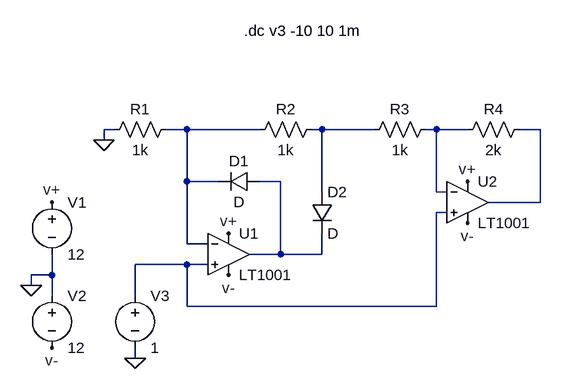
[diagram p0: schematic rect_preci1.asc]
rect_preci1.asc, the LTspice schematic file:
Version 4
SHEET 1 880 680
WIRE -32 0 -48 0
WIRE 80 0 48 0
WIRE 192 0 80 0
WIRE 288 0 272 0
WIRE 368 0 288 0
WIRE 464 0 448 0
WIRE 512 0 464 0
WIRE 624 0 592 0
WIRE -48 16 -48 0
WIRE 80 80 80 0
WIRE 128 80 80 80
WIRE 224 80 192 80
WIRE 288 96 288 0
WIRE 464 96 464 0
WIRE 480 96 464 96
WIRE 624 112 624 0
WIRE 624 112 544 112
WIRE 480 128 464 128
WIRE 80 176 80 80
WIRE 112 176 80 176
WIRE 224 192 224 80
WIRE 224 192 176 192
WIRE 288 192 288 160
WIRE 288 192 224 192
WIRE 80 208 0 208
WIRE 112 208 80 208
WIRE -128 224 -128 192
WIRE -128 224 -160 224
WIRE -160 240 -160 224
WIRE -128 256 -128 224
WIRE 0 256 0 208
WIRE 80 272 80 208
WIRE 464 272 464 128
WIRE 464 272 80 272
WIRE 0 352 0 336
FLAG -160 240 0
FLAG -128 112 v+
FLAG 144 160 v+
FLAG 512 80 v+
FLAG -128 336 v-
FLAG 144 224 v-
FLAG 512 144 v-
FLAG -48 16 0
FLAG 0 352 0
SYMBOL OpAmps\\LT1001 144 128 R0
SYMATTR InstName U1
SYMBOL OpAmps\\LT1001 512 48 R0
SYMATTR InstName U2
SYMBOL voltage -128 96 R0
WINDOW 123 0 0 Left 0
WINDOW 39 0 0 Left 0
SYMATTR InstName V1
SYMATTR Value 12
SYMBOL voltage -128 240 R0
WINDOW 123 0 0 Left 0
WINDOW 39 0 0 Left 0
SYMATTR InstName V2
SYMATTR Value 12
SYMBOL diode 192 64 R90
WINDOW 0 0 32 VBottom 2
WINDOW 3 32 32 VTop 2
SYMATTR InstName D1
SYMBOL diode 272 96 R0
SYMATTR InstName D2
SYMBOL res 64 -16 R90
WINDOW 0 0 56 VBottom 2
WINDOW 3 32 56 VTop 2
SYMATTR InstName R1
SYMATTR Value 1k
SYMBOL res 288 -16 R90
WINDOW 0 0 56 VBottom 2
WINDOW 3 32 56 VTop 2
SYMATTR InstName R2
SYMATTR Value 1k
SYMBOL res 464 -16 R90
WINDOW 0 0 56 VBottom 2
WINDOW 3 32 56 VTop 2
SYMATTR InstName R3
SYMATTR Value 1k
SYMBOL res 608 -16 R90
WINDOW 0 0 56 VBottom 2
WINDOW 3 32 56 VTop 2
SYMATTR InstName R4
SYMATTR Value 2k
SYMBOL voltage 0 240 R0
WINDOW 123 0 0 Left 0
WINDOW 39 0 0 Left 0
SYMATTR InstName V3
SYMATTR Value 1
TEXT 168 -152 Left 2 !.dc v3 -10 10 1m

The netlist it stands for:
* rect_preci1.asc
XU1 N006 N001 v+ v- N005 LT1001  ; pins In+ In- V+ V- OUT
XU2 N006 N003 v+ v- N004 LT1001  ; pins In+ In- V+ V- OUT
V1 v+ 0 12
V2 0 v- 12
D1 N005 N001 D
D2 N002 N005 D
R1 N001 0 1k
R2 N002 N001 1k
R3 N003 N002 1k
R4 N004 N003 2k
V3 N006 0 1
.model D D
.lib standard.dio
.dc v3 -10 10 1m
.lib LTC.lib
.backanno
.end